# Altium schematic sheet 2-mcu.SchDoc
size B
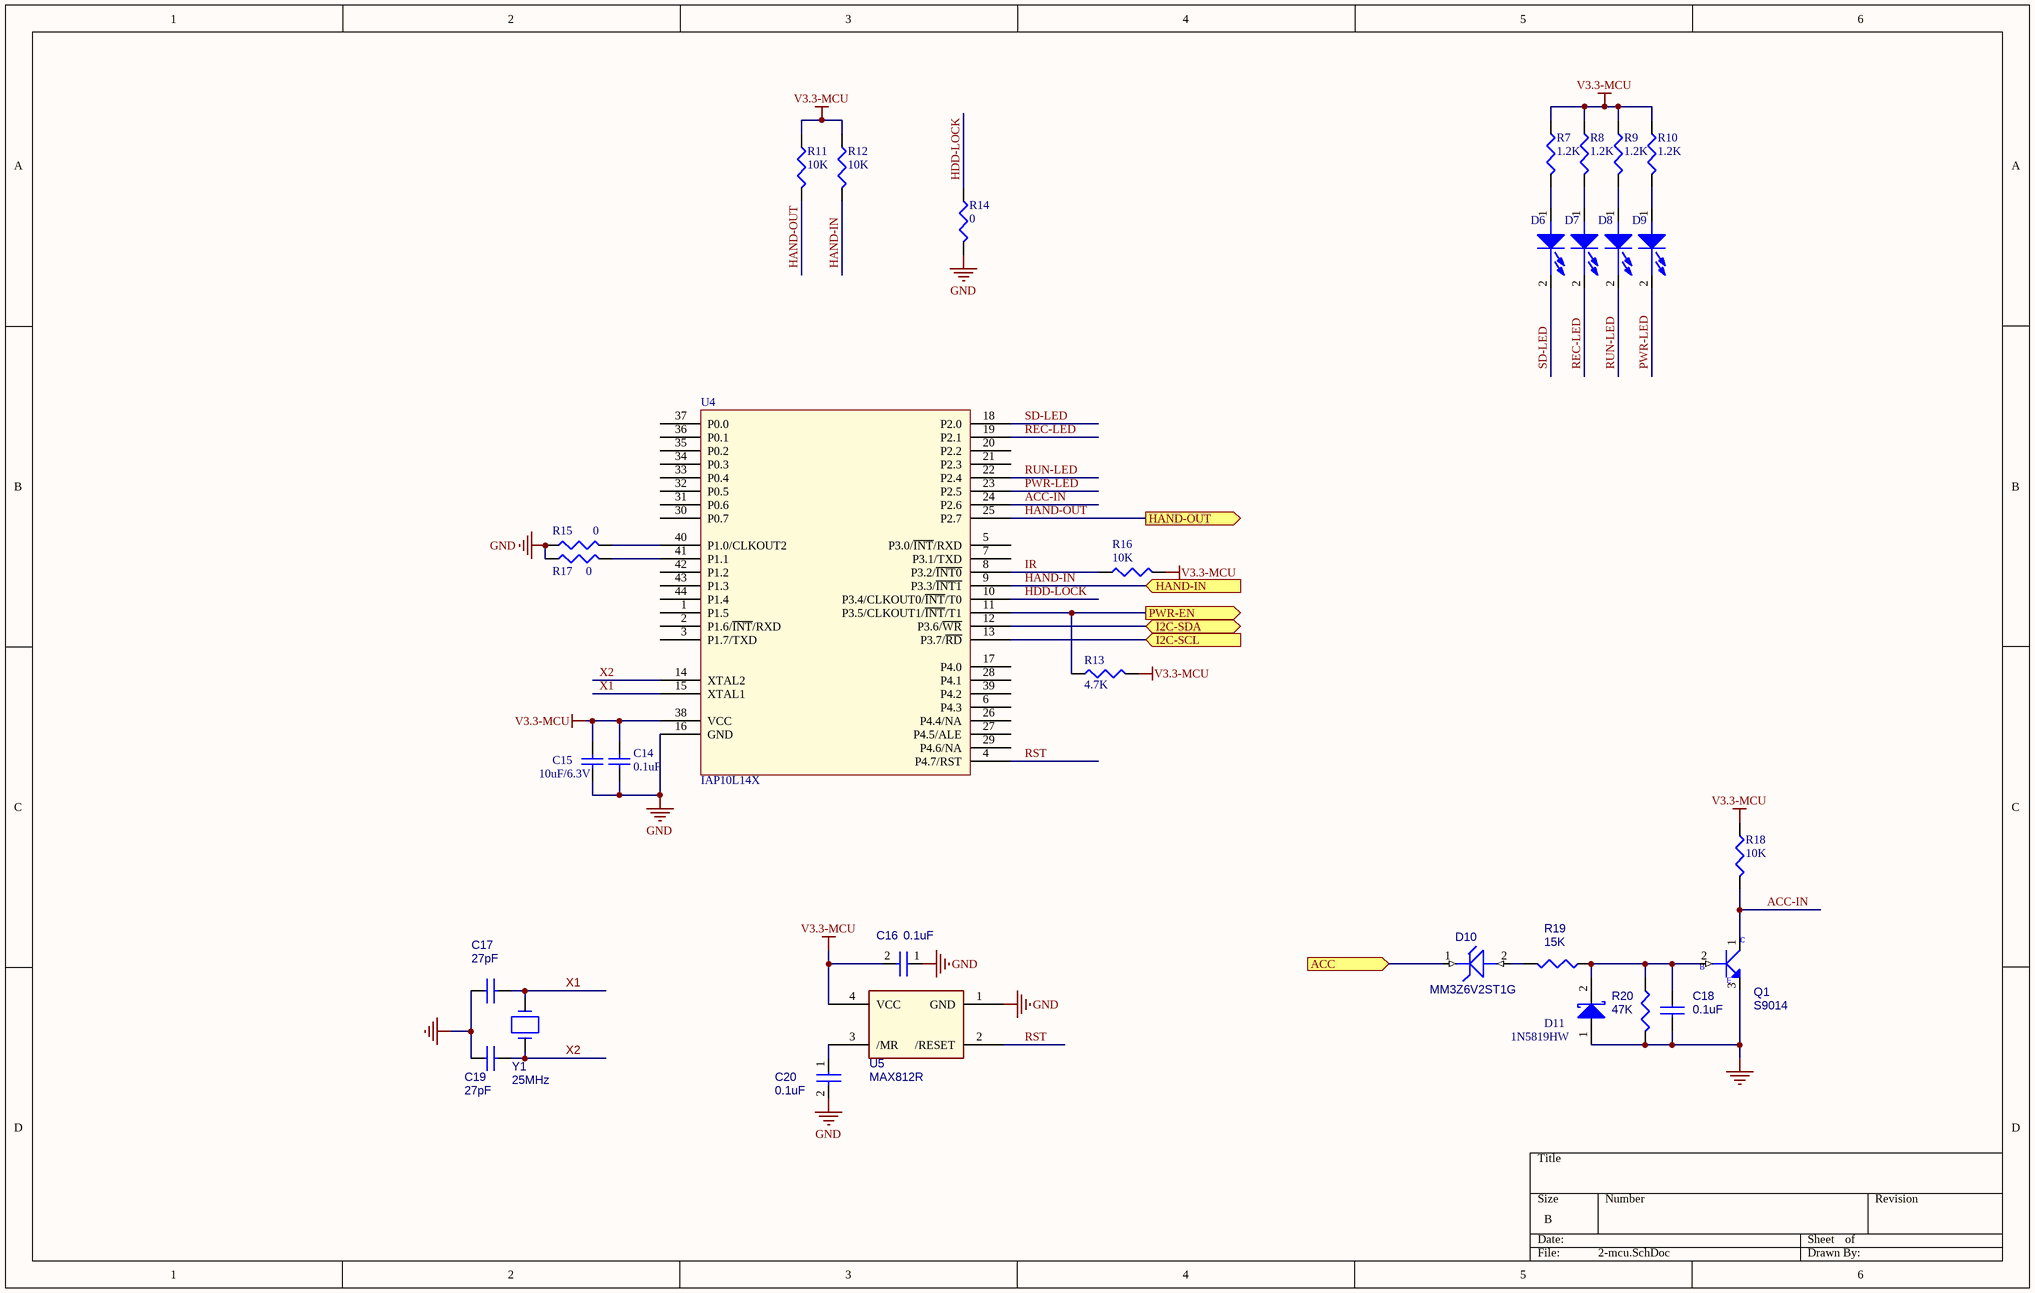
[diagram p0: 2-mcu.SchDoc]

## Parts
C14  0.1uF  [0603]
C15  10uF/6.3V  [0805]
C16  0.1uF  [0603]
C17  27pF  [0603]
C18  0.1uF  [0603]
C19  27pF  [0603]
C20  0.1uF  [0603]
D6  LED GREEN  [LED0603]  (value not drawn)
D7  LED GREEN  [LED0603]  (value not drawn)
D8  LED GREEN  [LED0603]  (value not drawn)
D9  LED GREEN  [LED0603]  (value not drawn)
D10  MM3Z6V2ST1G  [MM3Z5V1ST1G]
D11  1N5819HW  [1N5819]
Q1  S9014  [NPN]
R7  1.2K  [0603]
R8  1.2K  [0603]
R9  1.2K  [0603]
R10  1.2K  [0603]
R11  10K  [0603]
R12  10K  [0603]
R13  4.7K  [0603]
R14  0  [0603]
R15  0  [0603]
R16  10K  [0603]
R17  0  [0603]
R18  10K  [0603]
R19  15K  [0603]
R20  47K  [0603]
U4  IAP10L14X  [LQFP44]
U5  MAX812R  [SOT143]
Y1  25MHz  [SMD-XTAL-5032]

## Ports
ACC (in), HAND-IN (in), HAND-OUT (out), I2C-SCL (in), I2C-SDA (bidir), PWR-EN (out)

## Nets
GND: C14.1 C15.1 C16.1 C17.1 C18.2 C19.1 C20.2 D11.1(A) Q1.3(EMITTER) R14.2 R15.1 R17.1 R20.2 U4.16(GND) U5.1(GND)
V3.3-MCU: C14.2 C15.2 C16.2 R7.1 R8.1 R9.1 R10.1 R11.1 R12.1 R13.2 R16.2 R18.1 U4.38(VCC) U5.4(VCC)
ACC: D10.1 ; port ACC
ACC-IN: Q1.1(COLLECTOR) R18.2 U4.24(P2.6)
HAND-IN: R12.2 U4.9(P3.3/~{INT1}) ; port HAND-IN
HAND-OUT: R11.2 U4.25(P2.7) ; port HAND-OUT
HDD-LOCK: R14.1 U4.10(P3.4/CLKOUT0/~{INT}/T0)
I2C-SCL: U4.13(P3.7/~{RD}) ; port I2C-SCL
I2C-SDA: U4.12(P3.6/~{WR}) ; port I2C-SDA
IR: R16.1 U4.8(P3.2/~{INT0})
PWR-EN: R13.1 U4.11(P3.5/CLKOUT1/~{INT}/T1) ; port PWR-EN
PWR-LED: D9.2(CATHODE) U4.23(P2.5)
REC-LED: D7.2(CATHODE) U4.19(P2.1)
RST: U4.4(P4.7/RST) U5.2(/RESET)
RUN-LED: D8.2(CATHODE) U4.22(P2.4)
SD-LED: D6.2(CATHODE) U4.18(P2.0)
X1: C17.2 U4.15(XTAL1) Y1.2
X2: C19.2 U4.14(XTAL2) Y1.1
NetC18_1: C18.1 D11.2(K) Q1.2(BASE) R19.1 R20.1
NetC20_1: C20.1 U5.3(/MR)
NetD6_1: D6.1(ANODE) R7.2
NetD7_1: D7.1(ANODE) R8.2
NetD8_1: D8.1(ANODE) R9.2
NetD9_1: D9.1(ANODE) R10.2
NetD10_2: D10.2 R19.2
NetR15_2: R15.2 U4.40(P1.0/CLKOUT2)
NetR17_2: R17.2 U4.41(P1.1)

Not connected (* = marked no-connect by the designer): U4 1(P1.5) 2(P1.6/~{INT}/RXD) 3(P1.7/TXD) 5(P3.0/~{INT}/RXD) 6(P4.3) 7(P3.1/TXD) 17(P4.0) 20(P2.2) 21(P2.3) 26(P4.4/NA) 27(P4.5/ALE) 28(P4.1) 29(P4.6/NA) 30(P0.7) 31(P0.6) 32(P0.5) 33(P0.4) 34(P0.3) 35(P0.2) 36(P0.1) 37(P0.0) 39(P4.2) 42(P1.2) 43(P1.3) 44(P1.4)

## Notes on the sheet
- (in symbol MMBT3904_NL_SOT23-3) C; B; E

## Library data of the parts
C14 C15 = Cap: Capacitor
C16 C20 = CAP NP_Dup2
C17 C19 = CAP_Dup1
C18 = CAP
D6-D9 = LN01401_1
D10 = MMGZ5231BPTLL34
D11 = Diode 11DQ03: Schottky Rectifier
Q1 = MMBT3904_NL_SOT23-3: Part Description: S TR MMBT3904_NL NPN SOT23; Part Number: SB039040000
R7-R18 = CR16-1003FM
R19 R20 = R
U5 = MAX811
Y1 = CRYSTAL